# Altium schematic sheet SCH_Module_stm32wl55cc.SchDoc: Titulo
size OrCAD A; Author: Ismael Poblete V.; CompanyName: SME; Organization: SME; Address1: Santiago, Chile; DocumentNumber: SME-UNO; Revision: 1.0; SheetNumber: 1; SheetTotal: 1
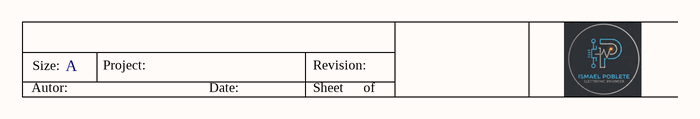
[diagram p0: SCH_Module_stm32wl55cc.SchDoc]

## Notes on the sheet
- Size:
- A
- Project:
- Revision:
- Autor:
- Date:
- Sheet
- of